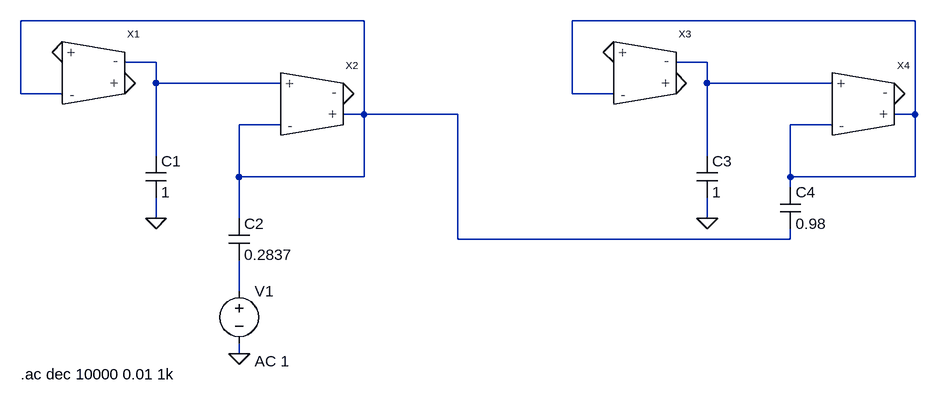
[diagram p0: schematic pasaaltos_OTA_norm.asc]
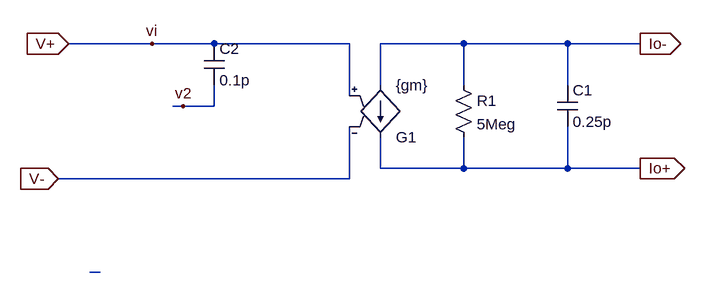
[diagram p1: sub-circuit otadif.asc]
pasaaltos_OTA_norm.asc, the LTspice schematic file:
Version 4
SHEET 1 1448 680
WIRE 288 16 -240 16
WIRE 1136 16 608 16
WIRE -32 80 -80 80
WIRE 816 80 768 80
WIRE -32 112 -32 80
WIRE 160 112 -32 112
WIRE 816 112 816 80
WIRE 1008 112 816 112
WIRE -240 128 -240 16
WIRE -176 128 -240 128
WIRE 608 128 608 16
WIRE 672 128 608 128
WIRE 288 160 288 16
WIRE 288 160 256 160
WIRE 432 160 288 160
WIRE 1136 160 1136 16
WIRE 1136 160 1104 160
WIRE 160 176 96 176
WIRE 1008 176 944 176
WIRE -32 224 -32 112
WIRE 816 224 816 112
WIRE 96 256 96 176
WIRE 288 256 288 160
WIRE 288 256 96 256
WIRE 944 256 944 176
WIRE 1136 256 1136 160
WIRE 1136 256 944 256
WIRE 944 272 944 256
WIRE -32 320 -32 288
WIRE 96 320 96 256
WIRE 816 320 816 288
WIRE 432 352 432 160
WIRE 944 352 944 336
WIRE 944 352 432 352
WIRE 96 432 96 384
WIRE 96 528 96 512
FLAG -176 64 0
FLAG -32 320 0
FLAG 256 128 0
FLAG -80 112 0
FLAG 96 528 0
FLAG 672 64 0
FLAG 816 320 0
FLAG 1104 128 0
FLAG 768 112 0
SYMBOL OTAdif -96 96 R0
SYMATTR InstName X1
SYMATTR SpiceLine gm = 1.47
SYMBOL OTAdif 240 144 R0
SYMATTR InstName X2
SYMATTR SpiceLine gm=0.68
SYMBOL cap -48 224 R0
SYMATTR InstName C1
SYMATTR Value 1
SYMBOL cap 80 320 R0
SYMATTR InstName C2
SYMATTR Value 0.2837
SYMBOL voltage 96 416 R0
WINDOW 123 24 124 Left 2
WINDOW 39 0 0 Left 0
SYMATTR Value2 AC 1
SYMATTR InstName V1
SYMATTR Value ""
SYMBOL OTAdif 752 96 R0
SYMATTR InstName X3
SYMATTR SpiceLine gm = 3.57
SYMBOL OTAdif 1088 144 R0
SYMATTR InstName X4
SYMATTR SpiceLine gm=0.28
SYMBOL cap 800 224 R0
SYMATTR InstName C3
SYMATTR Value 1
SYMBOL cap 928 272 R0
SYMATTR InstName C4
SYMATTR Value 0.98
TEXT -240 560 Left 2 !.ac dec 10000 0.01 1k

otadif.asc, the sub-circuit schematic file:
Version 4
SHEET 1 880 680
WIRE -128 64 -256 64
WIRE -32 64 -128 64
WIRE 176 64 -32 64
WIRE 352 64 224 64
WIRE 512 64 352 64
WIRE 624 64 512 64
WIRE 224 128 224 64
WIRE 352 128 352 64
WIRE 512 128 512 64
WIRE 176 144 176 64
WIRE -80 160 -96 160
WIRE -32 160 -32 128
WIRE -32 160 -80 160
WIRE 224 256 224 208
WIRE 352 256 352 208
WIRE 352 256 224 256
WIRE 512 256 512 192
WIRE 512 256 352 256
WIRE 624 256 512 256
WIRE 176 272 176 192
WIRE 176 272 -272 272
WIRE -208 416 -224 416
FLAG -128 64 vi
FLAG -80 160 v2
FLAG -256 64 V+
IOPIN -256 64 In
FLAG -272 272 V-
IOPIN -272 272 In
FLAG 624 64 Io-
IOPIN 624 64 Out
FLAG 624 256 Io+
IOPIN 624 256 Out
SYMBOL g2 224 224 M180
SYMATTR InstName G1
SYMATTR Value {gm}
SYMBOL cap 496 128 R0
SYMATTR InstName C1
SYMATTR Value 0.25p
SYMBOL res 336 112 R0
SYMATTR InstName R1
SYMATTR Value 5Meg
SYMBOL cap -48 64 R0
SYMATTR InstName C2
SYMATTR Value 0.1p

The netlist it stands for:
* pasaaltos_OTA_norm.asc
XX1 0 N001 N003 0 otadif params: gm = 1.47
XX2 N003 N001 0 N001 otadif params: gm=0.68
C1 N003 0 1
C2 N001 N005 0.2837
V1 N005 0 AC 1
XX3 0 N002 N004 0 otadif params: gm = 3.57
XX4 N004 N002 0 N002 otadif params: gm=0.28
C3 N004 0 1
C4 N002 N001 0.98

* block symbol definitions
.subckt otadif V+ V- Io- Io+
G1 Io- Io+ V+ V- {gm}
C1 Io- Io+ 0.25p
R1 Io- Io+ 5Meg
C2 V+ v2 0.1p
.ends otadif

.ac dec 10000 0.01 1k
.backanno
.end